# EAGLE schematic BBallboard (EAGLE 7.5.0)
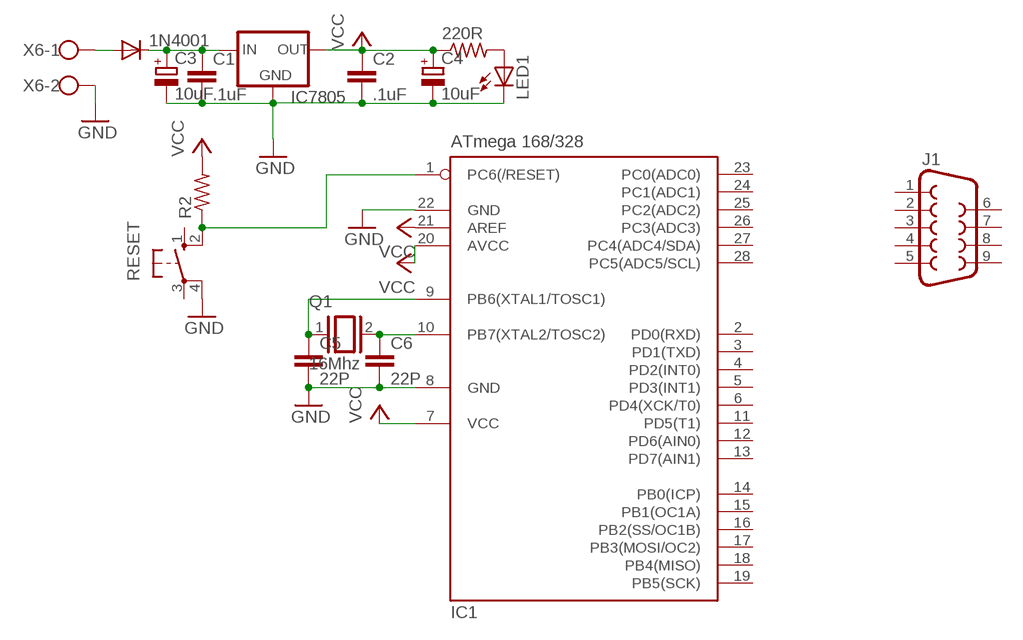
[diagram p0: schematic, sheet 1]

## Parts
1N4001  BYT85  [DO220S]
220R  R-US_0204/7  [0204/7]
C1  .1uF  C-EU025-024X044  [C025-024X044]
C2  .1uF  C-EU025-024X044  [C025-024X044]
C3  10uF  CPOL-EUE1.8-4  [E1,8-4]
C4  10uF  CPOL-EUE1.8-4  [E1,8-4]
C5  22P  C-EU025-024X044  [C025-024X044]
C6  22P  C-EU025-024X044  [C025-024X044]
IC1  ATmega 168/328  MEGA8-P  [DIL28-3]
IC7805  78XXS  [78XXS]
J1  DB9FEMALE  [DB9]
LED1  LED3MM  [LED3MM]
Q1  16Mhz  XTAL/S  [QS]
R2  R-US_0204/7  [0204/7]
RESET  10-XX  [B3F-10XX]
X6  W237-102  [W237-102]

## Nets
GND: C1.2 C2.2 C3.- C4.- C5.2 C6.2 IC1.8(GND) IC1.22(GND) IC7805.GND LED1.K(C) RESET.4(P1) X6.2
N$1: 1N4001.C C1.1 C3.+ IC7805.IN
N$21: 1N4001.A X6.1
N$23: 220R.2 LED1.A
N$24: C6.1 IC1.10(PB7(XTAL2/TOSC2)) Q1.2
N$25: C5.1 IC1.9(PB6(XTAL1/TOSC1)) Q1.1
N$26: IC1.1(PC6(/RESET)) R2.1 RESET.2(S1)
VCC: 220R.1 C2.1 C4.+ IC1.7(VCC) IC1.20(AVCC) IC1.21(AREF) IC7805.OUT R2.2
Unconnected: IC1.2(PD0(RXD)) IC1.3(PD1(TXD)) IC1.4(PD2(INT0)) IC1.5(PD3(INT1)) IC1.6(PD4(XCK/T0)) IC1.11(PD5(T1)) IC1.12(PD6(AIN0)) IC1.13(PD7(AIN1)) IC1.14(PB0(ICP)) IC1.15(PB1(OC1A)) IC1.16(PB2(SS/OC1B)) IC1.17(PB3(MOSI/OC2)) IC1.18(PB4(MISO)) IC1.19(PB5(SCK)) IC1.23(PC0(ADC0)) IC1.24(PC1(ADC1)) IC1.25(PC2(ADC2)) IC1.26(PC3(ADC3)) IC1.27(PC4(ADC4/SDA)) IC1.28(PC5(ADC5/SCL)) J1.1 J1.2 J1.3 J1.4 J1.5 J1.6 J1.7 J1.8 J1.9 RESET.1(S) RESET.3(P)

## Library data of the parts
1N4001 = diode:BYT85: DIODE
220R R2 = rcl:R-US_: RESISTOR, American symbol
C1 C2 C5 C6 = rcl:C-EU: CAPACITOR, European symbol
C3 C4 = rcl:CPOL-EU: POLARIZED CAPACITOR, European symbol
IC1 = atmel:MEGA8-P: MICROCONTROLLER 8 Kbytes FLASH, 1 kbytes SRAM, 512 bytes EEPROM, USART, 4-channel 10 bit ADC, 2-channel 8 bit ADC Pin compatible with Atmega48, ATMega88, ATMega168 Source: avr.lbr
IC7805 = v-reg:78XXS: VOLTAGE REGULATOR
J1 = SparkFun-Connectors:DB9: DB9 Connector Standard DB9 (D-Sub 9) serial connector. Can be used for CAN bus as well as RS485 and RS232. Footprint production proven. Spark Fun Electronics SKU : PRT-00429; PROD_ID: CONN-08194
LED1 = led:LED: LED OSRAM: - CHIPLED LG R971, LG N971, LY N971, LG Q971, LY Q971, LO R971, LY R971 LH N974, LH R974 LS Q976, LO Q976, LY Q976 LO Q996 - Hyper CHIPLED LW Q18S LB Q993, LB Q99A, LB R99A - SideLED LS A670, LO A670, LY A670, LG A670, LP A670 LB A673, LV A673, LT A673, LW A673 LH A674 LY A675 LS A676, LA A676, LO A676, LY A676, LW A676 LS A679, LY A679, LG A679 - Hyper Micro SIDELED® LS Y876, LA Y876, LO Y876, LY Y876 LT Y87S - SmartLED LW L88C, LW L88S LB L89C, LB L89S, LG L890 LS L89K, LO L89K, LY L89K LS L896, LA L896, LO L896, LY L896 - TOPLED LS T670, LO T670, LY T670, LG T670, LP T670 LSG T670, LSP T670, LSY T670, LOP T670, LYG T670 LG T671, LOG T671, LSG T671 LB T673, LV T673, LT T673, LW T673 LH T674 LS T676, LA T676, LO T676, LY T676, LB T676, LH T676, LSB T676, LW T676 LB T67C, LV T67C, LT T67C, LS T67K, LO T67K, LY T67K, LW E67C LS E67B, LA E67B, LO E67B, LY E67B, LB E67C, LV E67C, LT E67C LW T67C LS T679, LY T679, LG T679 LS T770, LO T770, LY T770, LG T770, LP T770 LB T773, LV T773, LT T773, LW T773 LH T774 LS E675, LA E675, LY E675, LS T675 LS T776, LA T776, LO T776, LY T776, LB T776 LHGB T686 LT T68C, LB T68C - Hyper Mini TOPLED® LB M676 - Mini TOPLED Santana® LG M470 LS M47K, LO M47K, LY M47K Source: http://www.osram.convergy.de LUXEON: - LUMILED® LXK2-PW12-R00, LXK2-PW12-S00, LXK2-PW14-U00, LXK2-PW14-V00 LXK2-PM12-R00, LXK2-PM12-S00, LXK2-PM14-U00 LXK2-PE12-Q00, LXK2-PE12-R00, LXK2-PE12-S00, LXK2-PE14-T00, LXK2-PE14-U00 LXK2-PB12-K00, LXK2-PB12-L00, LXK2-PB12-M00, LXK2-PB14-N00, LXK2-PB14-P00, LXK2-PB14-Q00 LXK2-PR12-L00, LXK2-PR12-M00, LXK2-PR14-Q00, LXK2-PR14-R00 LXK2-PD12-Q00, LXK2-PD12-R00, LXK2-PD12-S00 LXK2-PH12-R00, LXK2-PH12-S00 LXK2-PL12-P00, LXK2-PL12-Q00, LXK2-PL12-R00 Source: www.luxeon.com KINGBRIGHT: KA-3528ASYC Source: www.kingbright.com
Q1 = special:XTAL/S: CRYSTAL
RESET = switch-omron:10-XX: OMRON SWITCH
X6 = con-wago-500:W237-102: WAGO SCREW CLAMP